# Altium schematic sheet MCU.SchDoc
size 420 x 297 mm; DocumentNumber: АБВГ.123456.XXX Э3; SheetNumber: 2; SheetTotal: 4; PageSetup: Record=PageOptionsZCenterHorizontal=FalseZCenterVertical=FalseZPrintScale=0.95ZXCorrection=0.00ZYCorrection=0.00ZPrintKind=1ZBorderSize=5000000ZLeftOffset=0ZBottomOffset=0ZOrientation=1ZPaperLength=1000ZPaperWidth=1000ZScale=100ZPaperSource=15ZPrintQuality=600ZMediaType=1ZDitherType=10ZPaperKind=A4ZPrintScaleMode=1; DocumentCode: АБВГ.123456.XXX Э3
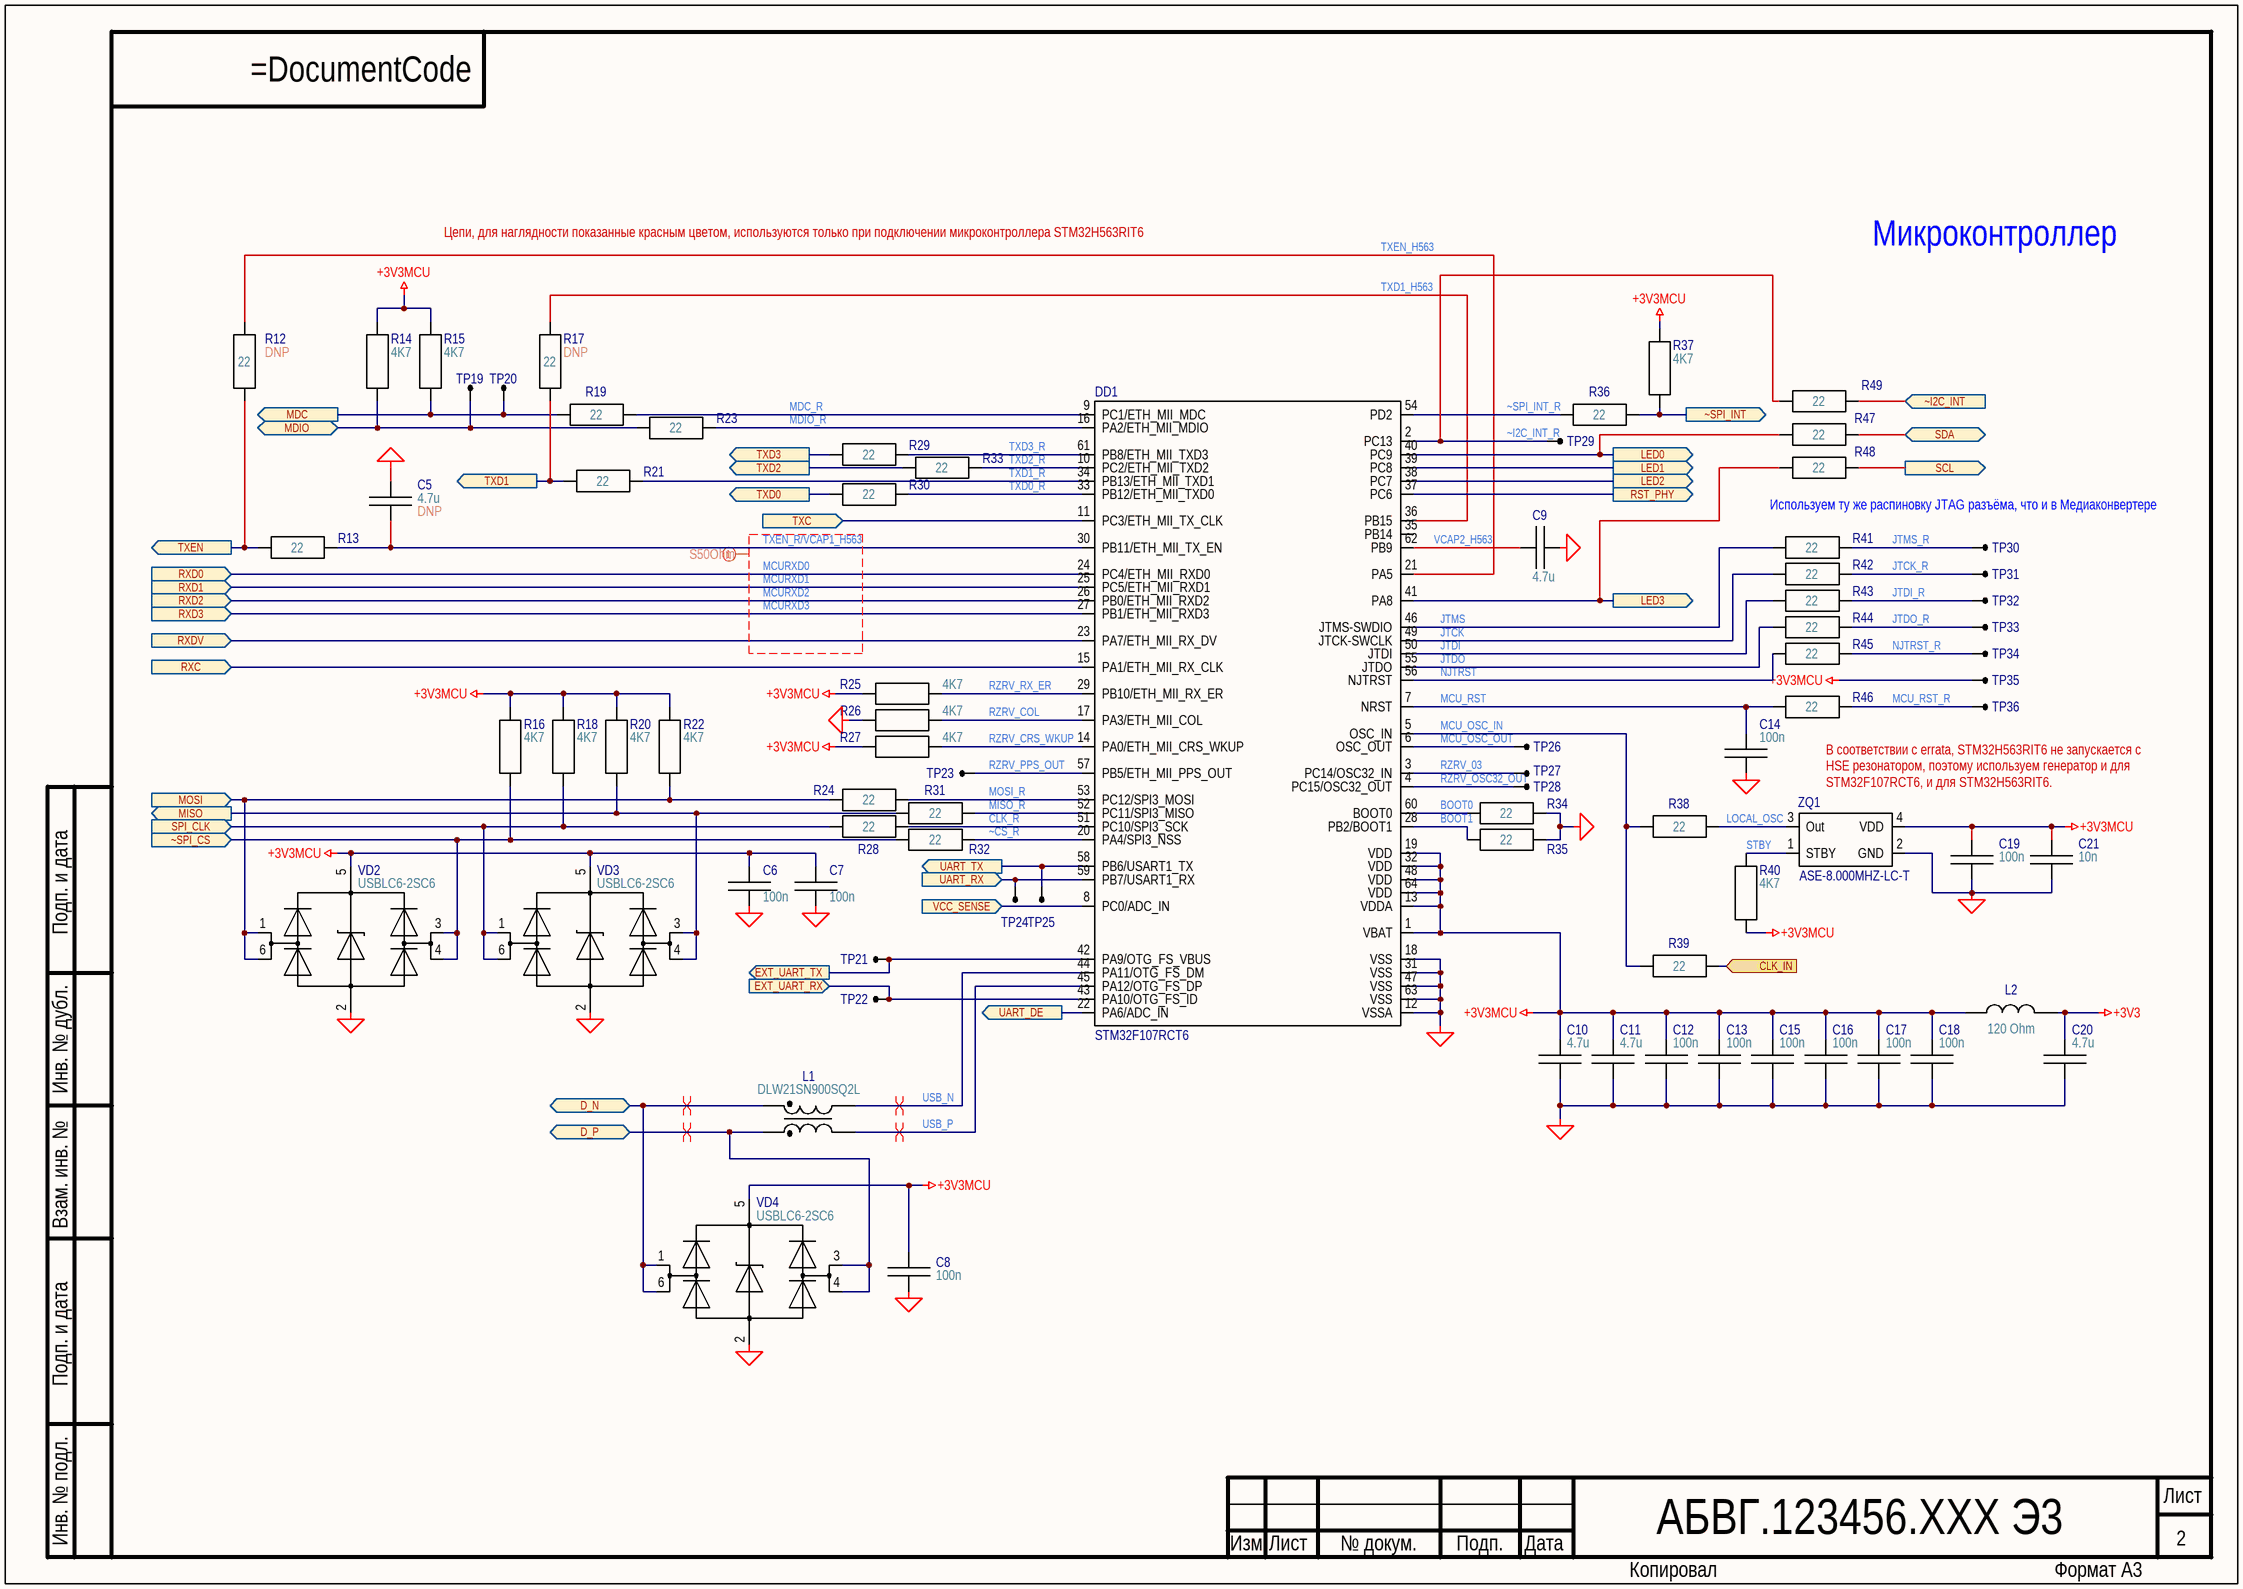
[diagram p0: MCU.SchDoc]

## Parts
C5  4.7u  [C0603]
C6  100n  [C0402]
C7  100n  [C0402]
C8  100n  [C0402]
C9  4.7u  [C0603]
C10  4.7u  [C0603]
C11  4.7u  [C0603]
C12  100n  [C0402]
C13  100n  [C0402]
C14  100n  [C0402]
C15  100n  [C0402]
C16  100n  [C0402]
C17  100n  [C0402]
C18  100n  [C0402]
C19  100n  [C0402]
C20  4.7u  [C0603]
C21  10n  [C0402]
DD1  STM32F107RCT6  [LQFP-64-STM-Microcontroller]
L1  DLW21SN900SQ2L  [DLW21S]
L2  120 Ohm  [BLM18PG]
R12  22  [R0402]
R13  22  [R0402]
R14  4K7  [R0402]
R15  4K7  [R0402]
R16  4K7  [R0402]
R17  22  [R0402]
R18  4K7  [R0402]
R19  22  [R0402]
R20  4K7  [R0402]
R21  22  [R0402]
R22  4K7  [R0402]
R23  22  [R0402]
R24  22  [R0402]
R25  4K7  [R0402]
R26  4K7  [R0402]
R27  4K7  [R0402]
R28  22  [R0402]
R29  22  [R0402]
R30  22  [R0402]
R31  22  [R0402]
R32  22  [R0402]
R33  22  [R0402]
R34  22  [R0402]
R35  22  [R0402]
R36  22  [R0402]
R37  4K7  [R0402]
R38  22  [R0402]
R39  22  [R0402]
R40  4K7  [R0402]
R41  22  [R0402]
R42  22  [R0402]
R43  22  [R0402]
R44  22  [R0402]
R45  22  [R0402]
R46  22  [R0402]
R47  22  [R0402]
R48  22  [R0402]
R49  22  [R0402]
TP19  TEST_POINT_1.27_STEP  [TEST_POINT_1.27_STEP]  (value not drawn)  (no BOM)
TP20  TEST_POINT_1.27_STEP  [TEST_POINT_1.27_STEP]  (value not drawn)  (no BOM)
TP21  TEST_POINT_1.27_STEP  [TEST_POINT_1.27_STEP]  (value not drawn)  (no BOM)
TP22  TEST_POINT_1.27_STEP  [TEST_POINT_1.27_STEP]  (value not drawn)  (no BOM)
TP23  TEST_POINT_SMD  [TEST_POINT_SMD]  (value not drawn)  (no BOM)
TP24  TEST_POINT_SMD  [TEST_POINT_SMD]  (value not drawn)  (no BOM)
TP25  TEST_POINT_SMD  [TEST_POINT_SMD]  (value not drawn)  (no BOM)
TP26  TEST_POINT_SMD  [TEST_POINT_SMD]  (value not drawn)  (no BOM)
TP27  TEST_POINT_SMD  [TEST_POINT_SMD]  (value not drawn)  (no BOM)
TP28  TEST_POINT_SMD  [TEST_POINT_SMD]  (value not drawn)  (no BOM)
TP29  TEST_POINT_SMD  [TEST_POINT_SMD]  (value not drawn)  (no BOM)
TP30  TEST_POINT_1.27_STEP  [TEST_POINT_1.27_STEP]  (value not drawn)  (no BOM)
TP31  TEST_POINT_1.27_STEP  [TEST_POINT_1.27_STEP]  (value not drawn)  (no BOM)
TP32  TEST_POINT_1.27_STEP  [TEST_POINT_1.27_STEP]  (value not drawn)  (no BOM)
TP33  TEST_POINT_1.27_STEP  [TEST_POINT_1.27_STEP]  (value not drawn)  (no BOM)
TP34  TEST_POINT_1.27_STEP  [TEST_POINT_1.27_STEP]  (value not drawn)  (no BOM)
TP35  TEST_POINT_1.27_STEP  [TEST_POINT_1.27_STEP]  (value not drawn)  (no BOM)
TP36  TEST_POINT_1.27_STEP  [TEST_POINT_1.27_STEP]  (value not drawn)  (no BOM)
VD2  USBLC6-2SC6  [SOT-23-6-USBLC-Internal-Jumpers]
VD3  USBLC6-2SC6  [SOT-23-6-USBLC-Internal-Jumpers]
VD4  USBLC6-2SC6  [SOT-23-6-USBLC-Internal-Jumpers]
ZQ1  ASE-8.000MHZ-LC-T  [ASE-X.XXXMHz]

## Ports
CLK_IN (in, see Struct), D_N (bidir, see Struct), D_P (bidir, see Struct), EXT_UART_RX (in, see Struct), EXT_UART_TX (out, see Struct), LED0 (out, see Struct), LED1 (out, see Struct), LED2 (out, see Struct), LED3 (out, see Struct), MDC (out, see Struct, T1L_PHY), MDIO (bidir, see Struct, T1L_PHY), MISO (out, see Struct), MOSI (in, see Struct), RST_PHY (out, see Struct, T1L_PHY), RXC (in, see Struct, T1L_PHY), RXD0 (in, see Struct, T1L_PHY), RXD1 (in, see Struct, T1L_PHY), RXD2 (in, see Struct, T1L_PHY), RXD3 (in, see Struct, T1L_PHY), RXDV (in, see Struct, T1L_PHY), SCL (out, see Struct), SDA (bidir, see Struct), SPI_CLK (in, see Struct), TXC (in, see Struct, T1L_PHY), TXD0 (out, see Struct, T1L_PHY), TXD1 (out, see Struct, T1L_PHY), TXD2 (out, see Struct, T1L_PHY), TXD3 (out, see Struct, T1L_PHY), TXEN (out, see Struct, T1L_PHY), UART_DE (out, see Struct, RS-485), UART_RX (in, see Struct, RS-485), UART_TX (out, see Struct, RS-485), VCC_SENSE (in, see Struct), ~I2C_INT (in, see Struct), ~SPI_CS (in, see Struct), ~SPI_INT (out, see Struct)

## Nets
+3V3: C20.1 L2.2
+3V3MCU: C6.2 C7.2 C8.2 C10.1 C11.1 C12.2 C13.2 C15.2 C16.2 C17.2 C18.2 C19.2 C21.2 DD1.1(VBAT) DD1.13(VDDA) DD1.19(VDD) DD1.32(VDD) DD1.48(VDD) DD1.64(VDD) L2.1 R14.2 R15.2 R16.2 R18.2 R20.2 R22.2 R25.2 R27.2 R37.2 R40.1 TP35.1 VD2.5 VD3.5 VD4.5 ZQ1.4(VDD)
GND: C5.1 C6.1 C7.1 C8.1 C9.2 C10.2 C11.2 C12.1 C13.1 C14.1 C15.1 C16.1 C17.1 C18.1 C19.1 C20.2 C21.1 DD1.12(VSSA) DD1.18(VSS) DD1.31(VSS) DD1.47(VSS) DD1.63(VSS) R26.2 R34.1 R35.1 VD2.2 VD3.2 VD4.2 ZQ1.2(GND)
BOOT0: DD1.60(BOOT0) R34.2
BOOT1: DD1.28(PB2/BOOT1) R35.2
CLK_IN: R39.1 ; port CLK_IN
CLK_R: DD1.51(PC10/SPI3_SCK) R28.1
D_N: L1.1 VD4.1 VD4.6 ; port D_N
D_P: L1.4 VD4.3 VD4.4 ; port D_P
EXT_UART_RX: DD1.43(PA10/OTG_FS_ID) TP22.1 ; port EXT_UART_RX
EXT_UART_TX: DD1.42(PA9/OTG_FS_VBUS) TP21.1 ; port EXT_UART_TX
JTCK: DD1.49(JTCK-SWCLK) R42.2
JTCK_R: R42.1 TP31.1
JTDI: DD1.50(JTDI) R43.2
JTDI_R: R43.1 TP32.1
JTDO: DD1.55(JTDO) R44.2
JTDO_R: R44.1 TP33.1
JTMS: DD1.46(JTMS-SWDIO) R41.2
JTMS_R: R41.1 TP30.1
LED0: DD1.40(PC9) R47.2 ; port LED0
LED1: DD1.39(PC8) ; port LED1
LED2: DD1.38(PC7) ; port LED2
LED3: DD1.41(PA8) R48.2 ; port LED3
LOCAL_OSC: R38.1 ZQ1.3(Out)
MCU_OSC_IN: DD1.5(OSC_IN) R38.2 R39.2
MCU_OSC_OUT: DD1.6(OSC_OUT) TP26.1
MCU_RST: C14.2 DD1.7(NRST) R46.2
MCU_RST_R: R46.1 TP36.1
MCURXD0: DD1.24(PC4/ETH_MII_RXD0) ; port RXD0
MCURXD1: DD1.25(PC5/ETH_MII_RXD1) ; port RXD1
MCURXD2: DD1.26(PB0/ETH_MII_RXD2) ; port RXD2
MCURXD3: DD1.27(PB1/ETH_MII_RXD3) ; port RXD3
MDC: R15.1 R19.2 TP20.1 ; port MDC
MDC_R: DD1.9(PC1/ETH_MII_MDC) R19.1
MDIO: R14.1 R23.2 TP19.1 ; port MDIO
MDIO_R: DD1.16(PA2/ETH_MII_MDIO) R23.1
MISO: R20.1 R31.2 VD3.3 VD3.4 ; port MISO
MISO_R: DD1.52(PC11/SPI3_MISO) R31.1
MOSI: R22.1 R24.2 VD2.1 VD2.6 ; port MOSI
MOSI_R: DD1.53(PC12/SPI3_MOSI) R24.1
NJTRST: DD1.56(NJTRST) R45.2
NJTRST_R: R45.1 TP34.1
RST_PHY: DD1.37(PC6) ; port RST_PHY
RXC: DD1.15(PA1/ETH_MII_RX_CLK) ; port RXC
RXDV: DD1.23(PA7/ETH_MII_RX_DV) ; port RXDV
RZRV_03: DD1.3(PC14/OSC32_IN) TP27.1
RZRV_COL: DD1.17(PA3/ETH_MII_COL) R26.1
RZRV_CRS_WKUP: DD1.14(PA0/ETH_MII_CRS_WKUP) R27.1
RZRV_OSC32_OUT: DD1.4(PC15/OSC32_OUT) TP28.1
RZRV_PPS_OUT: DD1.57(PB5/ETH_MII_PPS_OUT) TP23.1
RZRV_RX_ER: DD1.29(PB10/ETH_MII_RX_ER) R25.1
SCL: R48.1 ; port SCL
SDA: R47.1 ; port SDA
SPI_CLK: R18.1 R28.2 VD3.1 VD3.6 ; port SPI_CLK
STBY: R40.2 ZQ1.1(STBY)
TXC: DD1.11(PC3/ETH_MII_TX_CLK) ; port TXC
TXD0: R30.2 ; port TXD0
TXD0_R: DD1.33(PB12/ETH_MII_TXD0) R30.1
TXD1: R17.1 R21.2 ; port TXD1
TXD1_H563: DD1.36(PB15) R17.2
TXD1_R: DD1.34(PB13/ETH_MII_TXD1) R21.1
TXD2: R33.2 ; port TXD2
TXD2_R: DD1.10(PC2/ETH_MII_TXD2) R33.1
TXD3: R29.2 ; port TXD3
TXD3_R: DD1.61(PB8/ETH_MII_TXD3) R29.1
TXEN: R12.1 R13.1 ; port TXEN
TXEN_H563: DD1.21(PA5) R12.2
TXEN_R/VCAP1_H563: C5.2 DD1.30(PB11/ETH_MII_TX_EN) R13.2
UART_DE: DD1.22(PA6/ADC_IN) ; port UART_DE
UART_RX: DD1.59(PB7/USART1_RX) TP24.1 ; port UART_RX
UART_TX: DD1.58(PB6/USART1_TX) TP25.1 ; port UART_TX
USB_N: DD1.44(PA11/OTG_FS_DM) L1.2
USB_P: DD1.45(PA12/OTG_FS_DP) L1.3
VCAP2_H563: C9.1 DD1.62(PB9)
VCC_SENSE: DD1.8(PC0/ADC_IN) ; port VCC_SENSE
~CS_R: DD1.20(PA4/SPI3_NSS) R32.1
~I2C_INT: R49.1 ; port ~I2C_INT
~I2C_INT_R: DD1.2(PC13) R49.2 TP29.1
~SPI_CS: R16.1 R32.2 VD2.3 VD2.4 ; port ~SPI_CS
~SPI_INT: R36.1 R37.1 ; port ~SPI_INT
~SPI_INT_R: DD1.54(PD2) R36.2

Not connected (* = marked no-connect by the designer): DD1 35(PB14)

## Layout directives
differential pair: D_N, D_P, USB_N, USB_P
net class S50Ohm: MCURXD0, MCURXD1, MCURXD2, MCURXD3, TXEN_R/VCAP1_H563

## Notes on the sheet
- Цепи, для наглядности показанные красным цветом, используются только при подключении микроконтроллера STM32H563RIT6
- Микроконтроллер
- (near R12) DNP
- (near R17) DNP
- (near C5) DNP
- Используем ту же распиновку JTAG разъёма, что и в Медиаконвертере
- В соответствии с errata, STM32H563RIT6 не запускается с HSE резонатором, поэтому используем генератор и для STM32F107RCT6, и для STM32H563RIT6.
- Labels drawn without touching a wire or pin: =DocumentCode
- Подп. и дата
- Инв. № дубл.
- Взам. инв. №
- Инв. № подл.
- Лист
- Изм.
- № докум.
- Подп.
- Дата
- Копировал
- Формат А3

## Library data of the parts
C5 C9-C11 C20 = C0603: Чип-конденсатор 4,7 мкФ 10% 16 В X5R 0603; Manufacturer Part Number: CC0603KRX5R7BB475; Manufacturer: Yageo; TYPE: Чип-конденсатор 0603; Value: 4,7 мкФ 10% 16 В X5R; Component Type: Конденсатор
C6-C8 C12-C19 = C0402: Чип-конденсатор 100 нФ 10% 50 В X7R 0402; Manufacturer Part Number: CC0402KRX7R9BB104; Manufacturer: Yageo; Value: 100 нФ 10% 50 В X7R; Component Type: Конденсатор
C21 = C0402: Чип-конденсатор 10 нФ 10% 50 В X7R 0402; Manufacturer Part Number: CC0402KRX7R9BB103; Manufacturer: Yageo; Value: 10 нФ 10% 50 В X7R; Component Type: Конденсатор
DD1 = STM32F107RCT6: Микроконтроллер ARM; Manufacturer: ST Microelectronics; Component Type: Микроконтроллер; Manufacturer Part Number: STM32F107RCT6
L1 = DLW21SN900SQ2L: Фильтр синфазный DLW21SN900SQ2L; Manufacturer: Murata; Manufacturer Part Number: DLW21SN900SQ2L; Component Type: Фильтр синфазный
L2 = BLM18PG121SN1D: Фильтр индуктивный 120 Ом @ 100 МГц 2 А 0603; Manufacturer: FENGHUA Advanced Technology; Manufacturer Part Number: CBM160808U121T; VALUE: 120 Ом @ 100 МГц 2 А; Component Type: Фильтр индуктивный
R12 R13 R17 R19 R21 R23 R24 R28-R36 R38 R39 R41-R49 = R0402_tooth_1: Чип-резистор 22 Ом 1% 0402; Manufacturer Part Number: RC0402FR-0722RL; Manufacturer: Yageo; Value: 22 Ом 1%; Component Type: Резистор
R14-R16 R18 R20 R22 R25-R27 R37 R40 = R0402: Чип-резистор 4,7 кОм 1% 0402; Manufacturer Part Number: RC0402FR-074K7L; Manufacturer: Yageo; Value: 4,7 кОм 1%; Component Type: Резистор
TP19-TP22 TP30-TP36 = TEST_POINT_1.27_STEP: Контрольная точка SMD
TP23-TP29 = TEST_POINT_SMD: Контрольная точка SMD
VD2-VD4 = USBLC6-2SC6: Диодная сборка ESD защиты USBLC6-2SC6; Manufacturer: UMW; Manufacturer Part Number: USBLC6-2SC6; Component Type: Сборка диодная
ZQ1 = ASE-8.000MHZ-LC-T: Резонатор кварцевый 8.0 МГц; Manufacturer: Abracon; Component Type: Кварцевый генератор; Manufacturer Part Number: ASE-8.000MHZ-LC-T